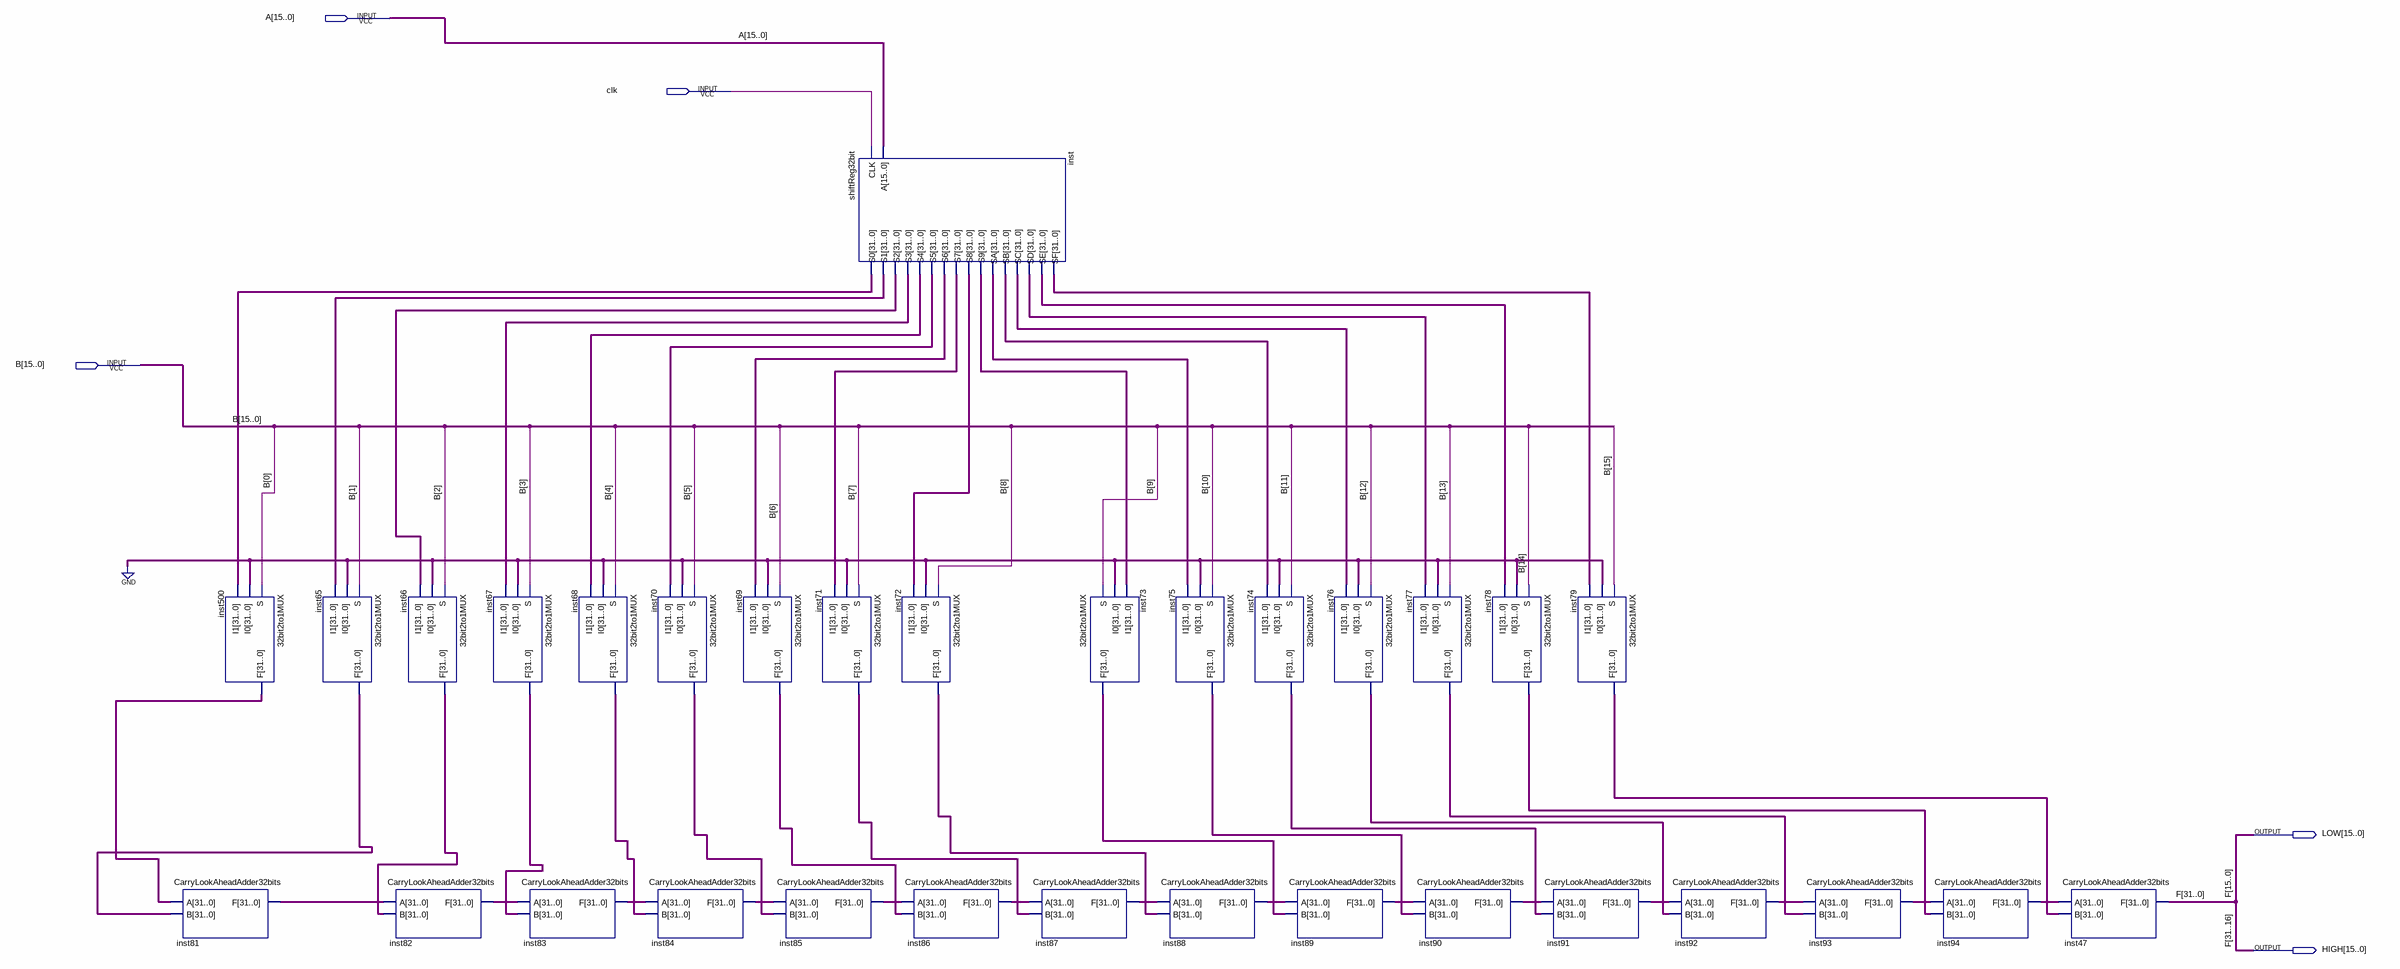
[diagram p0: schematic sheet]
// Quartus schematic Multiplier.bdf as structural Verilog: 32 symbols, 5 pins
module Multiplier (
  input  [15:0] A,
  input  clk,
  input  [15:0] B,
  output [15:0] LOW,
  output [15:0] HIGH
);

  wire [31:0] inst65_f, inst66_f, inst67_f, inst68_f, inst69_f, inst70_f, inst71_f, inst72_f, inst73_f,
       inst74_f, inst75_f, inst76_f, inst77_f, inst78_f, inst79_f, inst81_f, inst82_f, inst83_f, inst84_f,
       inst85_f, inst86_f, inst87_f, inst88_f, inst89_f, inst90_f, inst91_f, inst92_f, inst93_f, inst94_f,
       inst500_f, inst_s0, inst_s1, inst_s2, inst_s3, inst_s4, inst_s5, inst_s6, inst_s7, inst_s8, inst_s9,
       inst_sa, inst_sb, inst_sc, inst_sd, inst_se, inst_sf;

  CarryLookAheadAdder32bits inst81 (.A(inst500_f), .B(inst65_f), .F(inst81_f));
  \32bit2to1MUX  inst500 (.S(B[0]), .I0({32{1'b0}}), .I1(inst_s0), .F(inst500_f));
  \32bit2to1MUX  inst65 (.S(B[1]), .I0({32{1'b0}}), .I1(inst_s1), .F(inst65_f));
  \32bit2to1MUX  inst66 (.S(B[2]), .I0({32{1'b0}}), .I1(inst_s2), .F(inst66_f));
  CarryLookAheadAdder32bits inst82 (.A(inst81_f), .B(inst66_f), .F(inst82_f));
  \32bit2to1MUX  inst67 (.S(B[3]), .I0({32{1'b0}}), .I1(inst_s3), .F(inst67_f));
  CarryLookAheadAdder32bits inst83 (.A(inst82_f), .B(inst67_f), .F(inst83_f));
  \32bit2to1MUX  inst68 (.S(B[4]), .I0({32{1'b0}}), .I1(inst_s4), .F(inst68_f));
  \32bit2to1MUX  inst70 (.S(B[5]), .I0({32{1'b0}}), .I1(inst_s5), .F(inst70_f));
  CarryLookAheadAdder32bits inst84 (.A(inst83_f), .B(inst68_f), .F(inst84_f));
  \32bit2to1MUX  inst69 (.S(B[6]), .I0({32{1'b0}}), .I1(inst_s6), .F(inst69_f));
  \32bit2to1MUX  inst71 (.S(B[7]), .I0({32{1'b0}}), .I1(inst_s7), .F(inst71_f));
  CarryLookAheadAdder32bits inst85 (.A(inst84_f), .B(inst70_f), .F(inst85_f));
  shiftReg32bit inst (
    .CLK(clk), .A(A), .S0(inst_s0), .S1(inst_s1), .S2(inst_s2), .S3(inst_s3), .S4(inst_s4), .S5(inst_s5),
    .S6(inst_s6), .S7(inst_s7), .S8(inst_s8), .S9(inst_s9), .SA(inst_sa), .SB(inst_sb), .SC(inst_sc),
    .SD(inst_sd), .SE(inst_se), .SF(inst_sf));
  \32bit2to1MUX  inst72 (.S(B[8]), .I0({32{1'b0}}), .I1(inst_s8), .F(inst72_f));
  CarryLookAheadAdder32bits inst86 (.A(inst85_f), .B(inst69_f), .F(inst86_f));
  CarryLookAheadAdder32bits inst87 (.A(inst86_f), .B(inst71_f), .F(inst87_f));
  \32bit2to1MUX  inst73 (.S(B[9]), .I0({32{1'b0}}), .I1(inst_s9), .F(inst73_f));
  CarryLookAheadAdder32bits inst88 (.A(inst87_f), .B(inst72_f), .F(inst88_f));
  \32bit2to1MUX  inst75 (.S(B[10]), .I0({32{1'b0}}), .I1(inst_sa), .F(inst75_f));
  \32bit2to1MUX  inst74 (.S(B[11]), .I0({32{1'b0}}), .I1(inst_sb), .F(inst74_f));
  CarryLookAheadAdder32bits inst89 (.A(inst88_f), .B(inst73_f), .F(inst89_f));
  \32bit2to1MUX  inst76 (.S(B[12]), .I0({32{1'b0}}), .I1(inst_sc), .F(inst76_f));
  \32bit2to1MUX  inst77 (.S(B[13]), .I0({32{1'b0}}), .I1(inst_sd), .F(inst77_f));
  CarryLookAheadAdder32bits inst90 (.A(inst89_f), .B(inst75_f), .F(inst90_f));
  \32bit2to1MUX  inst78 (.S(B[14]), .I0({32{1'b0}}), .I1(inst_se), .F(inst78_f));
  CarryLookAheadAdder32bits inst91 (.A(inst90_f), .B(inst74_f), .F(inst91_f));
  \32bit2to1MUX  inst79 (.S(B[15]), .I0({32{1'b0}}), .I1(inst_sf), .F(inst79_f));
  CarryLookAheadAdder32bits inst92 (.A(inst91_f), .B(inst76_f), .F(inst92_f));
  CarryLookAheadAdder32bits inst93 (.A(inst92_f), .B(inst77_f), .F(inst93_f));
  CarryLookAheadAdder32bits inst94 (.A(inst93_f), .B(inst78_f), .F(inst94_f));
  CarryLookAheadAdder32bits inst47 (.A(inst94_f), .B(inst79_f), .F({HIGH, LOW}));

  // Other names for the same wires on the sheet: F[31:0] = {HIGH, LOW}
endmodule
